# EasyEDA schematic GuitarMultiEffect.json
TITLE: Sheet_1; REV: 1.0; Date: 2023-09-30; Sheet: 1/1; Company: Your Company
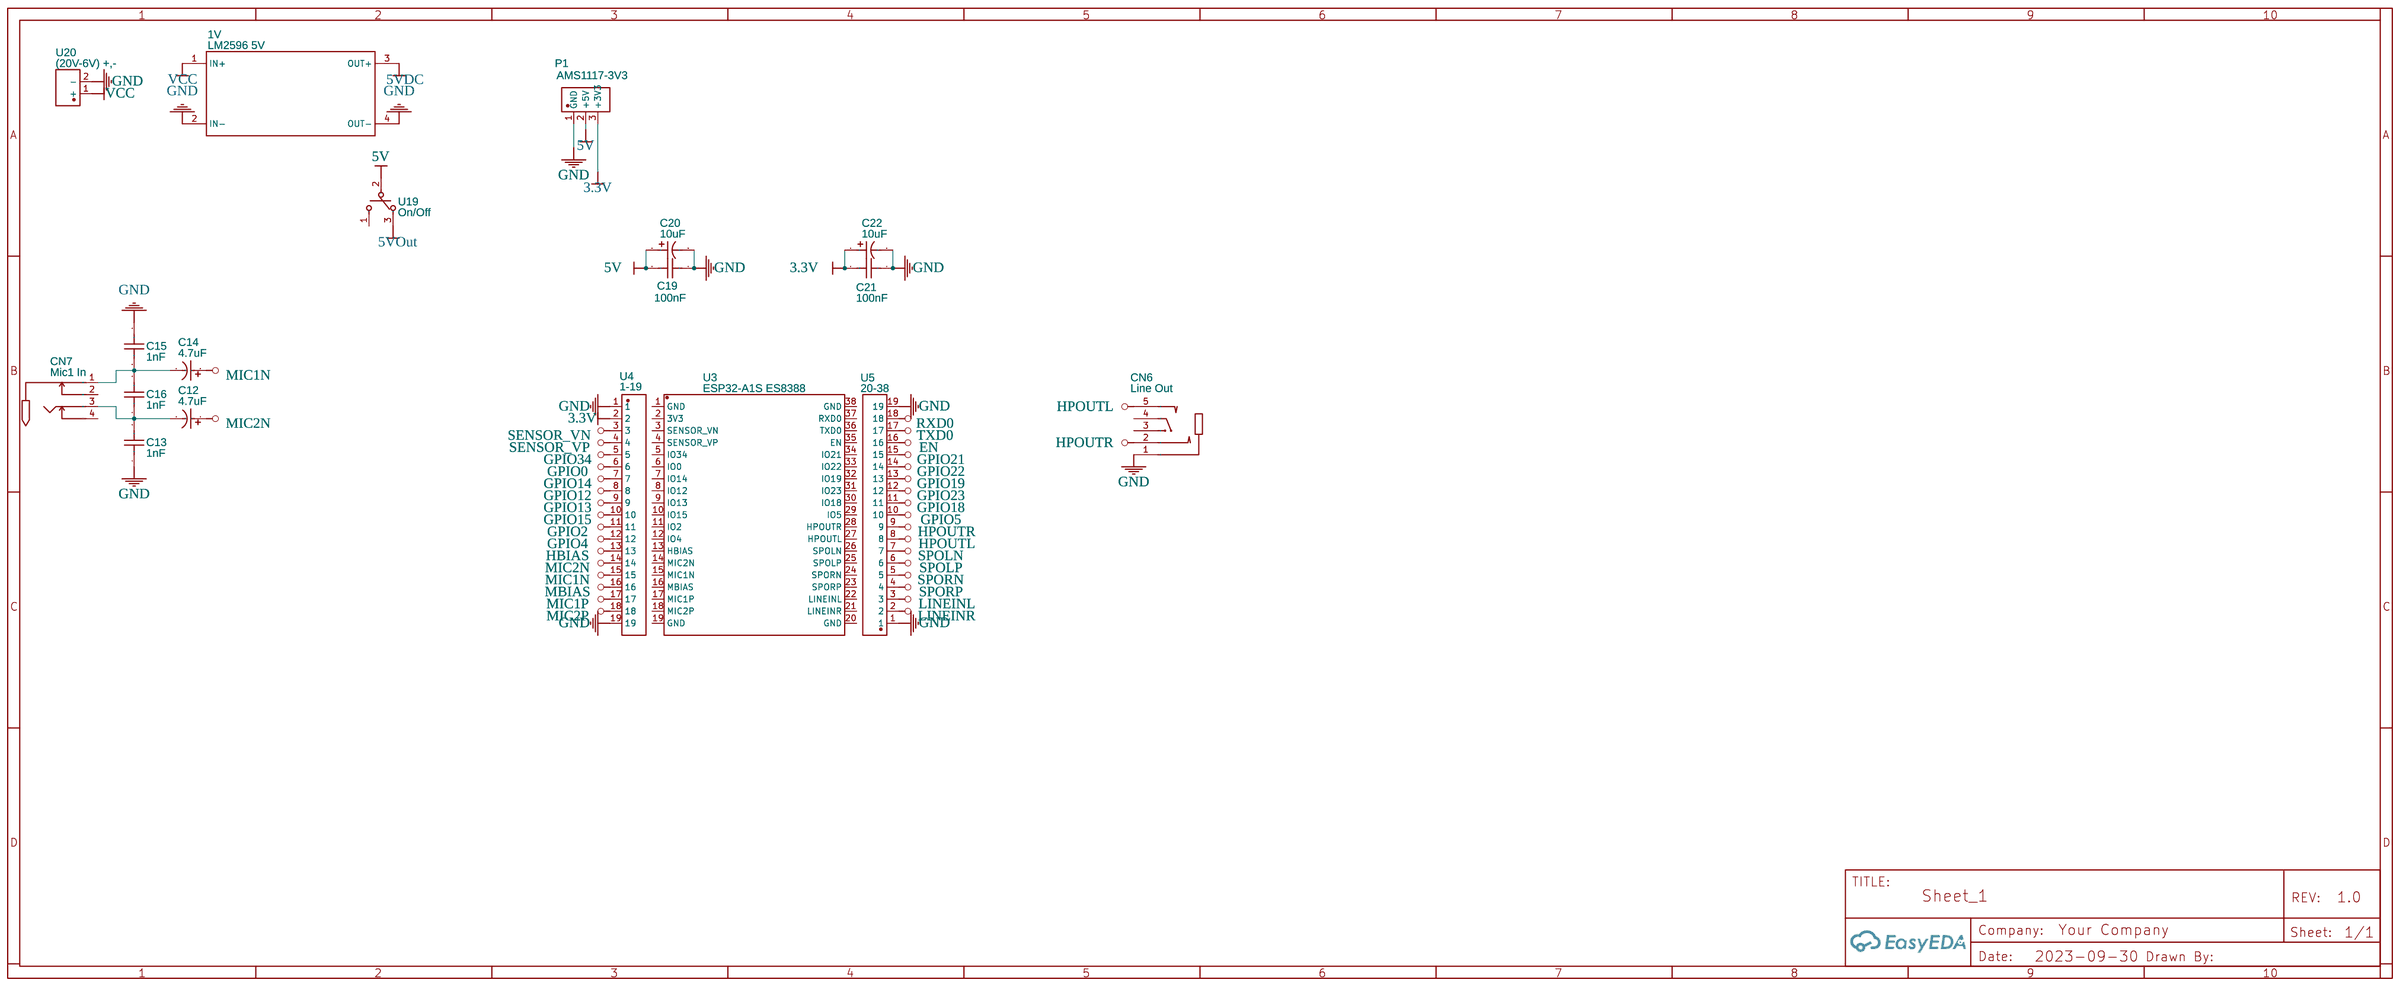
[diagram p0: schematic sheet]

## Parts
1V  LM2596 5V  [LM2596]
C12  4.7uF  [CAP-TH_BD5.0-P2.00-D0.8-FD]
C13  1nF  [CAP-TH_L8.0-W4.0-P5.00-D0.7]
C14  4.7uF  [CAP-TH_BD5.0-P2.00-D0.8-FD]
C15  1nF  [CAP-TH_L8.0-W4.0-P5.00-D0.7]
C16  1nF  [CAP-TH_L8.0-W4.0-P5.00-D0.7]
C19  100nF  [CAP-TH_L6.5-W4.0-P5.00-D1.0]
C20  10uF  [CAP-TH_BD5.0-P2.00-D0.5-FD-1]
C21  100nF  [CAP-TH_L6.5-W4.0-P5.00-D1.0]
C22  10uF  [CAP-TH_BD5.0-P2.00-D0.5-FD-1]
CN6  Line Out  [AUDIO-TH_XKB_PJ-3062-HD-R]
CN7  Mic1 In  [AUDIO-TH_CK6.35-3-15-6]
P1  AMS1117-3V3  [1X3-PIN-HEADER-2.54MM_ES]
U3  ESP32-A1S ES8388  [ESP32-A1S]
U4  1-19  [HDR-TH_19P-P1.27-V-M]
U5  20-38  [HDR-TH_19P-P1.27-V-M]
U19  On/Off  [SW-TH_MT-0-103-A101-M200-RS]
U20  (20V-6V) +,-  [CONN-TH_2P-P5.08_DB128L-5.08-2P]

## Library data of the parts
1V = LM2596: Contributor: Gabriel Nalin Bettanin; Supplier: Carls
C12 C14 = 4.7uF 50V 5*11: Supplier: LCSC; Manufacturer: CX(承兴); Manufacturer Part: KM475M050D11RR0VH2FP0; Supplier Part: C43344; JLCPCB Part Class: Extended Part; link: https://lcsc.com/eda_search?q=C43344&%26type=1&ref=editor
C13 C15 C16 = R08B1B102KN0B0S0N0: Contributor: LCSC; Supplier: LCSC; Supplier Part: C249166; Manufacturer: STE(松田); JLCPCB Part Class: Extended Part; link: https://lcsc.com/eda_search?q=C249166&%26type=1&ref=editor
C19 C21 = CL112J103J0501: Contributor: LCSC; Supplier: LCSC; Supplier Part: C424418; Manufacturer: KYET(科雅); JLCPCB Part Class: Extended Part; link: https://lcsc.com/eda_search?q=C424418&%26type=1&ref=editor
C20 C22 = 50V10UF CD110_C2960373: Contributor: lcsc; Supplier: LCSC; Supplier Part: C2960373; Manufacturer: HRK(鸿瑞凯电子); Manufacturer Part: 50V10uF CD110; link: https://lcsc.com/eda_search?q=C2960373&%26type=1&ref=editor
CN6 = PJ-3062-HD-R: Contributor: LCSC; Supplier: LCSC; Supplier Part: C668225; Manufacturer: XKB Connectivity(中国星坤); JLCPCB Part Class: Extended Part; link: https://lcsc.com/eda_search?q=C668225&%26type=1&ref=editor
CN7 = CK6.35-3+15-6: Contributor: LCSC; Supplier: LCSC; Supplier Part: C718060; Manufacturer: JINJIA(金佳); JLCPCB Part Class: Extended Part; link: https://lcsc.com/eda_search?q=C718060&%26type=1&ref=editor
P1 = Header 1x3: Supplier: LCSC; Supplier Part: C705186; Manufacturer: XFCN; Manufacturer Part: M3025V-1x6P; Contributor: erzyk; JLCPCB Part Class: Extended Part
U3 = ESP32-A1S: Supplier: LCSC; Supplier Part: C277945; Manufacturer: Ai-Thinker; Contributor: zqx100
U4 U5 = X1311WV-19J-C18D27: Contributor: LCSC; Supplier: LCSC; Supplier Part: C2881664; Manufacturer: XKB Connectivity(中国星坤); JLCPCB Part Class: Extended Part; link: https://lcsc.com/eda_search?q=C2881664&%26type=1&ref=editor
U19 = MT-0-103-A101-M200-RS+PJ: Contributor: lcsc; Supplier: LCSC; Supplier Part: C1788493; Manufacturer: YUEN FUNG(源丰); JLCPCB Part Class: Extended Part; link: https://lcsc.com/eda_search?q=C1788493&%26type=1&ref=editor
U20 = DB128L-5.08-2P: Contributor: LCSC; Supplier: LCSC; Supplier Part: C395868; Manufacturer: DIBO(地博电气); Manufacturer Part: DB128L-5.08-2P-GN-S; JLCPCB Part Class: Extended Part; link: https://lcsc.com/eda_search?q=C395868&%26type=1&ref=editor

## Nets
3.3V: C21.2 C22.1 P1.3(+3V3) U4.2
5V: C19.2 C20.1 P1.2(+5V) U19.2
5VDC: 1V.3(OUT+)
5VOut: U19.3
GND: 1V.2(IN-) 1V.4(OUT-) C13.1 C15.1 C19.1 C20.2 C21.1 C22.2 CN6.1 P1.1(GND) U4.1 U4.19 U5.1 U5.19 U20.2(-)
VCC: 1V.1(IN+) U20.1(+)
EN: U5.16
GPIO0: U4.6
GPIO2: U4.11
GPIO4: U4.12
GPIO5: U5.10
GPIO12: U4.8
GPIO13: U4.9
GPIO14: U4.7
GPIO15: U4.10
GPIO18: U5.11
GPIO19: U5.13
GPIO21: U5.15
GPIO22: U5.14
GPIO23: U5.12
GPIO34: U4.5
HBIAS: U4.13
HPOUTL: CN6.5 U5.8
HPOUTR: CN6.2 U5.9
LINEINL: U5.3
LINEINR: U5.2
MBIAS: U4.16
MIC1N: C14.1 U4.15
MIC1P: U4.17
MIC2N: C12.1 U4.14
MIC2P: U4.18
RXD0: U5.18
SENSOR_VN: U4.3
SENSOR_VP: U4.4
SPOLN: U5.7
SPOLP: U5.6
SPORN: U5.5
SPORP: U5.4
TXD0: U5.17
Net-(C12-2): C12.2 C13.2 C16.1 CN7.3
Net-(C14-2): C14.2 C15.2 C16.2 CN7.1

Not connected (* = marked no-connect by the designer): CN6 3 4; CN7 2 4; U3 1(GND) 2(3V3) 3(SENSOR_VN) 4(SENSOR_VP) 5(IO34) 6(IO0) 7(IO14) 8(IO12) 9(IO13) 10(IO15) 11(IO2) 12(IO4) 13(HBIAS) 14(MIC2N) 15(MIC1N) 16(MBIAS) 17(MIC1P) 18(MIC2P) 19(GND) 20(GND) 21(LINEINR) 22(LINEINL) 23(SPORP) 24(SPORN) 25(SPOLP) 26(SPOLN) 27(HPOUTL) 28(HPOUTR) 29(IO5) 30(IO18) 31(IO23) 32(IO19) 33(IO22) 34(IO21) 35(EN) 36(TXD0) 37(RXD0) 38(GND); U19 1
